# Altium schematic sheet IO_board_Top.SchDoc
size 294 x 198 mm
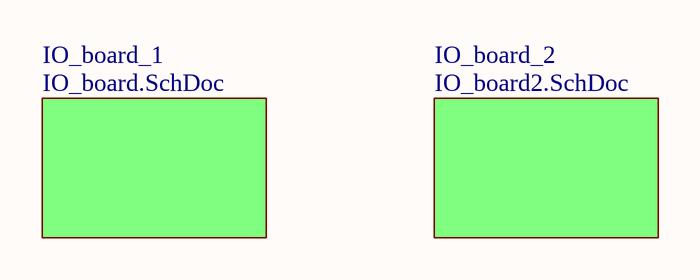
[diagram p0: IO_board_Top.SchDoc]

## Sub-sheets
IO_board_1 = IO_board.SchDoc: no entries
IO_board_2 = IO_board2.SchDoc: no entries